# Altium project ANALOG_CAN_BOARD_2018.PrjPCB
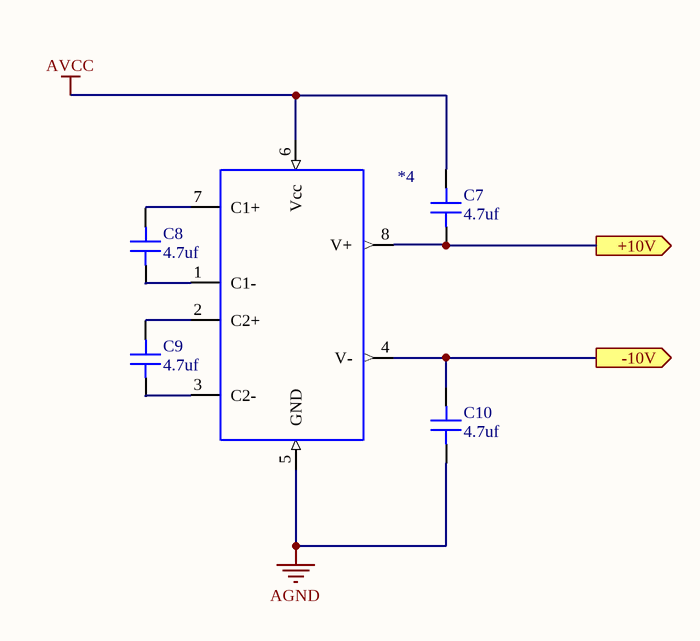
[diagram p0: MAX680_10V_Converter.SchDoc]
6 sheets, 50 parts. Net scope: hierarchical (ports join the sheet entries above them; power ports are global).
Board file: ANALOG_CAN2.PcbDoc
Sheets:
  MAX680_10V_Converter.SchDoc
  TopLevel.SchDoc
    U_Connectors = Connectors.SchDoc
    U_5V Reference = 5V Reference.SchDoc
    U_OVP_MCU_PINS = OVP_MCU_PINS.SchDoc
  Sallen-Key Filter.SchDoc

## Sheet MAX680_10V_Converter.SchDoc
size A

### Parts
*4  Null  [SOIC-8]  (value not drawn)
C7  value 4.7uf  [CAP 0805/2012]  (hidden comment: Capacitor MLCC 4.7uf 16V CAP 0805/2012)
C8  value 4.7uf  [CAP 0805/2012]  (hidden comment: Capacitor MLCC 4.7uf 16V CAP 0805/2012)
C9  value 4.7uf  [CAP 0805/2012]  (hidden comment: Capacitor MLCC 4.7uf 16V CAP 0805/2012)
C10  value 4.7uf  [CAP 0805/2012]  (hidden comment: Capacitor MLCC 4.7uf 16V CAP 0805/2012)

### Ports
+10V (out), -10V (out)

### Nets
AGND: *4.5(GND) C10.1
AVCC: *4.6(Vcc) C7.2
Net*4_1: *4.1(C1-) C8.1
Net*4_2: *4.2(C2+) C9.2
Net*4_3: *4.3(C2-) C9.1
Net*4_4: *4.4(V-) C10.2 ; port -10V
Net*4_7: *4.7(C1+) C8.2
Net*4_8: *4.8(V+) C7.1 ; port +10V

### Library data of the parts
*4 = 14: IC REG SWTCHD CAP INV 10MA 8SOIC; Manufacturer_id: 1; idPMIC_Lin: 14; Name: MAX680CSA; Value: 10V; Output_Config: Fixed; Num_Outputs: 2; Vin(Min): 2V; Vin(Max): 6V; Vout(Min): +2Vin; Created_By: Albert Panuco; Drawer_id: 1; Power: Null; Vout(Max): 10V; Vout_Type: Null; Current_Rating: 10mA; Dropout_Voltage: Null; Package: SOIC-8; MfrPartNo: MAX680CSA; Link: https://www.digikey.com/product-detail/en/maxim-integrated/MAX680CSA/MAX680CSA-ND/142563; ComponentLink1Description: Null; ComponentLink1URL: Null; Supplier1: Null; Supplier1PartNo: Null; Updated_By: Null
C7-C10 = 353: Manufacturer_id: 1; idCapacitor: 353; Name: Cap_4.7uf_16V_CAP 0805/2012; Dielectric: Ceramic; Created_By: Nick Mah; Drawer_id: 1; Voltage_Rating: 16V; Package: CAP 0805/2012; Created_Date: 10/20/2018

## Sheet TopLevel.SchDoc
size A
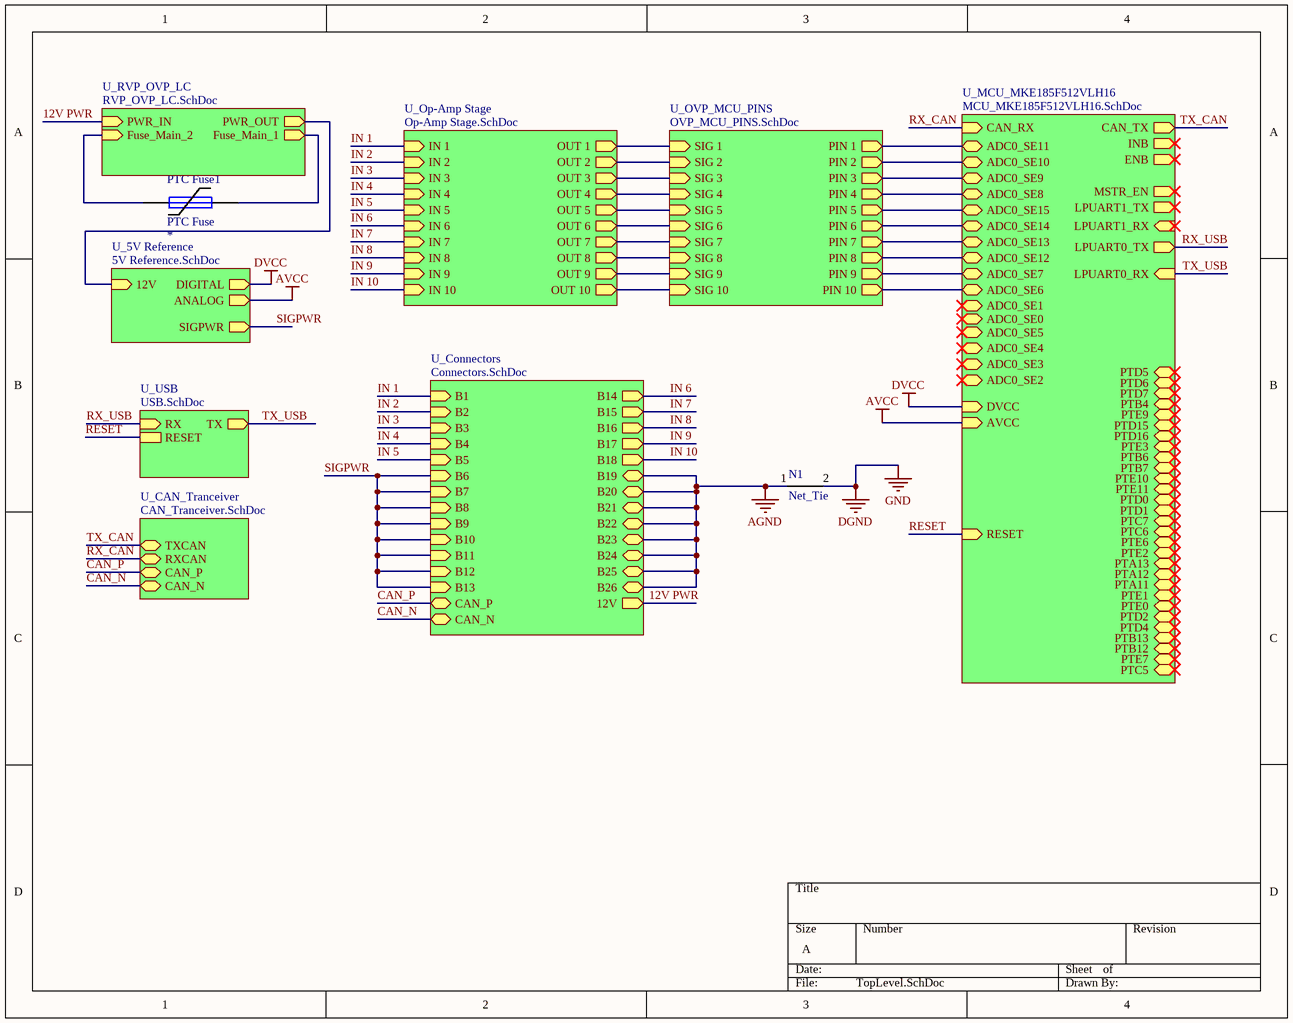
[diagram p1: TopLevel.SchDoc]

### Parts
N1  Net_Tie  [Net_Tie]  (net tie, no BOM)
PTC_Fuse1  PTC Fuse  [PTC Fuse 2920/07351]

### Sub-sheets
U_5V Reference = 5V Reference.SchDoc: 12V (in), DIGITAL (out), ANALOG (out), SIGPWR (out)
U_CAN_Tranceiver = CAN_Tranceiver.SchDoc (file not in this document): TXCAN (bidir), RXCAN (bidir), CAN_P (bidir), CAN_N (bidir)
U_Connectors = Connectors.SchDoc: B1 (in), B2 (in), B3 (in), B4 (in), B5 (in), B6 (in), B7 (in), B8 (in), B9 (in), B10 (in), B11 (in), B12 (in), B13 (in), B14 (out), B15 (out), B16 (out), B17 (out), B18 (out), B19 (bidir), B20 (bidir), B21 (bidir), B22 (bidir), B23 (bidir), B24 (bidir), B25 (bidir), B26 (bidir), 12V (out), CAN_N (bidir), CAN_P (bidir)
U_MCU_MKE185F512VLH16 = MCU_MKE185F512VLH16.SchDoc (file not in this document): CAN_TX (out), CAN_RX (in), INB (out), ENB (out), ADC0_SE11 (bidir), ADC0_SE10 (bidir), ADC0_SE9 (bidir), ADC0_SE8 (bidir), ADC0_SE15 (bidir), ADC0_SE14 (bidir), ADC0_SE13 (bidir), ADC0_SE12 (bidir), ADC0_SE7 (bidir), ADC0_SE6 (bidir), ADC0_SE1 (bidir), ADC0_SE0 (bidir), LPUART0_TX (out), LPUART0_RX (in), MSTR_EN (out), ADC0_SE5 (bidir), ADC0_SE4 (bidir), LPUART1_TX (out), LPUART1_RX (in), ADC0_SE3 (bidir), ADC0_SE2 (bidir), DVCC (in), AVCC (in), PTD5 (bidir), PTD6 (bidir), PTD7 (bidir), PTB4 (bidir), PTE9 (bidir), PTD15 (bidir), PTD16 (bidir), PTE3 (bidir), PTB6 (bidir), PTB7 (bidir), PTE10 (bidir), PTE11 (bidir), PTD0 (bidir), PTD1 (bidir), PTC7 (bidir), PTC6 (bidir), PTE6 (bidir), PTE2 (bidir), PTA13 (bidir), PTA12 (bidir), PTA11 (bidir), PTE1 (bidir), PTE0 (bidir), RESET (in), PTD2 (bidir), PTD4 (bidir), PTB13 (bidir), PTB12 (bidir), PTE7 (bidir), PTC5 (bidir)
U_Op-Amp Stage = Op-Amp Stage.SchDoc (file not in this document): OUT 1 (out), OUT 2 (out), OUT 3 (out), OUT 4 (out), OUT 5 (out), OUT 6 (out), OUT 7 (out), OUT 8 (out), OUT 9 (out), OUT 10 (out), IN 1 (in), IN 2 (in), IN 3 (in), IN 4 (in), IN 5 (in), IN 6 (in), IN 7 (in), IN 8 (in), IN 9 (in), IN 10 (in)
U_OVP_MCU_PINS = OVP_MCU_PINS.SchDoc: SIG 1 (in), SIG 2 (in), PIN 1 (out), PIN 2 (out), SIG 3 (in), SIG 4 (in), PIN 3 (out), PIN 4 (out), SIG 5 (in), SIG 6 (in), PIN 5 (out), PIN 6 (out), SIG 7 (in), SIG 8 (in), PIN 7 (out), PIN 8 (out), SIG 9 (in), SIG 10 (in), PIN 9 (out), PIN 10 (out)
U_RVP_OVP_LC = RVP_OVP_LC.SchDoc (file not in this document): PWR_IN (in), PWR_OUT (out), Fuse_Main_2 (in), Fuse_Main_1 (out)
U_USB = USB.SchDoc (file not in this document): TX (out), RX (in), RESET

### Nets
AGND: N1.1 ; sheet U_Connectors/B19, sheet U_Connectors/B20, sheet U_Connectors/B21, sheet U_Connectors/B22, sheet U_Connectors/B23, sheet U_Connectors/B24, sheet U_Connectors/B25, sheet U_Connectors/B26
AVCC: sheet U_5V Reference/ANALOG, sheet U_MCU_MKE185F512VLH16/AVCC
DGND: N1.2  [also labelled GND]
DVCC: sheet U_5V Reference/DIGITAL, sheet U_MCU_MKE185F512VLH16/DVCC
12V: sheet U_RVP_OVP_LC/PWR_OUT, sheet U_5V Reference/12V
12V PWR: sheet U_RVP_OVP_LC/PWR_IN, sheet U_Connectors/12V
CAN_N: sheet U_CAN_Tranceiver/CAN_N, sheet U_Connectors/CAN_N
CAN_P: sheet U_CAN_Tranceiver/CAN_P, sheet U_Connectors/CAN_P
IN 1: sheet U_Connectors/B1, sheet U_Op-Amp Stage/IN 1
IN 2: sheet U_Connectors/B2, sheet U_Op-Amp Stage/IN 2
IN 3: sheet U_Connectors/B3, sheet U_Op-Amp Stage/IN 3
IN 4: sheet U_Connectors/B4, sheet U_Op-Amp Stage/IN 4
IN 5: sheet U_Connectors/B5, sheet U_Op-Amp Stage/IN 5
IN 6: sheet U_Connectors/B14, sheet U_Op-Amp Stage/IN 6
IN 7: sheet U_Connectors/B15, sheet U_Op-Amp Stage/IN 7
IN 8: sheet U_Connectors/B16, sheet U_Op-Amp Stage/IN 8
IN 9: sheet U_Connectors/B17, sheet U_Op-Amp Stage/IN 9
IN 10: sheet U_Connectors/B18, sheet U_Op-Amp Stage/IN 10
RESET: sheet U_USB/RESET, sheet U_MCU_MKE185F512VLH16/RESET
RX_CAN: sheet U_CAN_Tranceiver/RXCAN, sheet U_MCU_MKE185F512VLH16/CAN_RX
RX_USB: sheet U_USB/RX, sheet U_MCU_MKE185F512VLH16/LPUART0_TX
SIGPWR: sheet U_Connectors/B6, sheet U_Connectors/B7, sheet U_Connectors/B8, sheet U_Connectors/B9, sheet U_Connectors/B10, sheet U_Connectors/B11, sheet U_Connectors/B12, sheet U_Connectors/B13, sheet U_5V Reference/SIGPWR
TX_CAN: sheet U_CAN_Tranceiver/TXCAN, sheet U_MCU_MKE185F512VLH16/CAN_TX
TX_USB: sheet U_USB/TX, sheet U_MCU_MKE185F512VLH16/LPUART0_RX
NetA1_1: sheet U_OVP_MCU_PINS/PIN 1, sheet U_MCU_MKE185F512VLH16/ADC0_SE11
NetA1_2: sheet U_OVP_MCU_PINS/PIN 2, sheet U_MCU_MKE185F512VLH16/ADC0_SE10
NetA2_1: sheet U_OVP_MCU_PINS/PIN 3, sheet U_MCU_MKE185F512VLH16/ADC0_SE9
NetA2_2: sheet U_OVP_MCU_PINS/PIN 4, sheet U_MCU_MKE185F512VLH16/ADC0_SE8
NetA3_1: sheet U_OVP_MCU_PINS/PIN 5, sheet U_MCU_MKE185F512VLH16/ADC0_SE15
NetA3_2: sheet U_OVP_MCU_PINS/PIN 6, sheet U_MCU_MKE185F512VLH16/ADC0_SE14
NetA4_1: sheet U_OVP_MCU_PINS/PIN 7, sheet U_MCU_MKE185F512VLH16/ADC0_SE13
NetA4_2: sheet U_OVP_MCU_PINS/PIN 8, sheet U_MCU_MKE185F512VLH16/ADC0_SE12
NetA5_1: sheet U_OVP_MCU_PINS/PIN 9, sheet U_MCU_MKE185F512VLH16/ADC0_SE7
NetA5_2: sheet U_OVP_MCU_PINS/PIN 10, sheet U_MCU_MKE185F512VLH16/ADC0_SE6
NetPTC_Fuse1_1: PTC_Fuse1.1 ; sheet U_RVP_OVP_LC/Fuse_Main_2
NetPTC_Fuse1_2: PTC_Fuse1.2 ; sheet U_RVP_OVP_LC/Fuse_Main_1
NetR6_2: sheet U_OVP_MCU_PINS/SIG 1, sheet U_Op-Amp Stage/OUT 1
NetR7_2: sheet U_OVP_MCU_PINS/SIG 2, sheet U_Op-Amp Stage/OUT 2
NetR8_2: sheet U_OVP_MCU_PINS/SIG 3, sheet U_Op-Amp Stage/OUT 3
NetR9_2: sheet U_OVP_MCU_PINS/SIG 4, sheet U_Op-Amp Stage/OUT 4
NetR10_2: sheet U_OVP_MCU_PINS/SIG 5, sheet U_Op-Amp Stage/OUT 5
NetR11_2: sheet U_OVP_MCU_PINS/SIG 6, sheet U_Op-Amp Stage/OUT 6
NetR12_2: sheet U_OVP_MCU_PINS/SIG 7, sheet U_Op-Amp Stage/OUT 7
NetR13_2: sheet U_OVP_MCU_PINS/SIG 8, sheet U_Op-Amp Stage/OUT 8
NetR14_2: sheet U_OVP_MCU_PINS/SIG 9, sheet U_Op-Amp Stage/OUT 9
NetR15_2: sheet U_OVP_MCU_PINS/SIG 10, sheet U_Op-Amp Stage/OUT 10

### Library data of the parts
N1 = 1: Manufacturer_id: 1; idFuse: 3; Name: Net Tie; Drawer_id: 1; idShunt: 1
PTC_Fuse1 = 4: Fuse; Manufacturer_id: 1; MfrPartNo: 2920L200; idFuse: 4; Name: PTC Poly Fuse Resettable; Value: 2A hold, 4A trip, 40A max; I_hold: 2A; I_trip: 4A; I_max: 40A; Created_By: Eunice Bernardo; Published: 8-Jun-2000; LatestRevisionDate: 17-Jul-2002; LatestRevisionNote: Re-released for DXP Platform.; PackageReference: PIN-W2/E2.8; Publisher: Altium Limited; PackageDescription: Thru-Hole; 2 Leads; I-hold: *; Drawer_id: 1; Link: https://www.digikey.com/product-detail/en/littelfuse-inc/2920L200-24DR/F2872TR-ND/1211346; Created_Date: 10/27/2018

## Sheet Connectors.SchDoc
size A
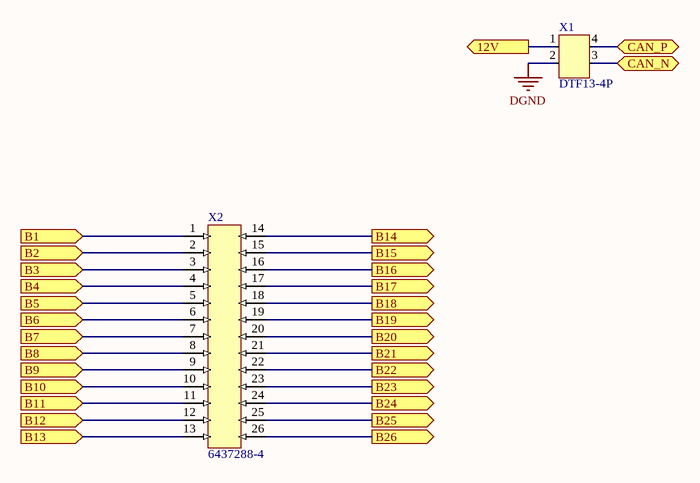
[diagram p2: Connectors.SchDoc]

### Parts
X1  DTF13-4P  [DTF13-4P]
X2  6437288-4  [SUPERSEAL 26POS 90Deg]

### Ports
12V (out), B1 (in), B2 (in), B3 (in), B4 (in), B5 (in), B6 (in), B7 (in), B8 (in), B9 (in), B10 (in), B11 (in), B12 (in), B13 (in), B14 (out), B15 (out), B16 (out), B17 (out), B18 (out), B19 (out), B20 (out), B21 (out), B22 (out), B23 (out), B24 (out), B25 (out), B26 (out), CAN_N (bidir), CAN_P (bidir)

### Nets
AGND: X2.19 X2.20 X2.21 X2.22 X2.23 X2.24 X2.25 X2.26 ; port B19, port B20, port B21, port B22, port B23, port B24, port B25, port B26
DGND: X1.2
12V PWR: X1.1 ; port 12V
CAN_N: X1.3 ; port CAN_N
CAN_P: X1.4 ; port CAN_P
IN 1: X2.1 ; port B1
IN 2: X2.2 ; port B2
IN 3: X2.3 ; port B3
IN 4: X2.4 ; port B4
IN 5: X2.5 ; port B5
IN 6: X2.14 ; port B14
IN 7: X2.15 ; port B15
IN 8: X2.16 ; port B16
IN 9: X2.17 ; port B17
IN 10: X2.18 ; port B18
SIGPWR: X2.6 X2.7 X2.8 X2.9 X2.10 X2.11 X2.12 X2.13 ; port B6, port B7, port B8, port B9, port B10, port B11, port B12, port B13

### Library data of the parts
X1 = 15: 2 row 4 pin Board; Manufacturer_id: 1; idConn: 15; Value: CONN; Num_Contacts: 4; Created_By: Angel; MfrPartNo: DTF13-4P; Drawer_id: 1; Name: DTF13-4P; Link: https://www.te.com/usa-en/product-DTF13-4P.html; ComponentLink1Description: Datasheet; Supplier1: TE
X2 = 21: 4 row connector; Manufacturer_id: 1; idConn: 21; Name: AMP Superseal 90Deg; Value: CONN; Num_Contacts: 26; Num_Rows: 4; Pitch: 3mm; Created_By: Angel; MfrPartNo: 6437288-4; Drawer_id: 1; Link: https://www.te.com/usa-en/product-6437288-4.html#guest-click; ComponentLink1Description: Datasheet; Supplier1: TE

## Sheet 5V Reference.SchDoc
size A
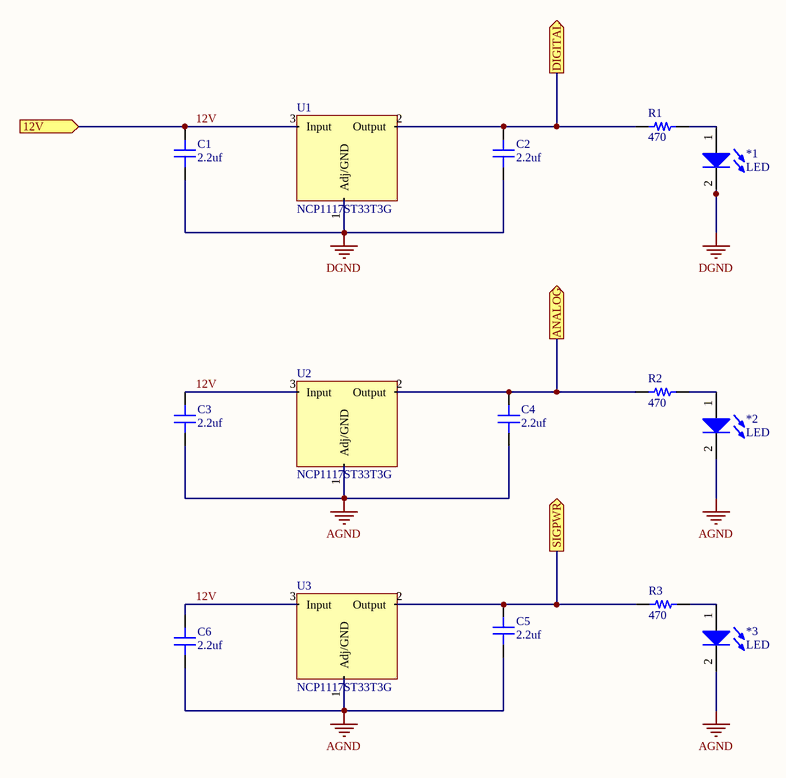
[diagram p3: 5V Reference.SchDoc]

### Parts
*1  LED  [0805_LED]
*2  LED  [0805_LED]
*3  LED  [0805_LED]
C1  value 2.2uf  [CAP 0805/2012]  (hidden comment: Capacitor MLCC 2.2uf 25V CAP 0805/2012)
C2  value 2.2uf  [CAP 0805/2012]  (hidden comment: Capacitor MLCC 2.2uf 25V CAP 0805/2012)
C3  value 2.2uf  [CAP 0805/2012]  (hidden comment: Capacitor MLCC 2.2uf 25V CAP 0805/2012)
C4  value 2.2uf  [CAP 0805/2012]  (hidden comment: Capacitor MLCC 2.2uf 25V CAP 0805/2012)
C5  value 2.2uf  [CAP 0805/2012]  (hidden comment: Capacitor MLCC 2.2uf 25V CAP 0805/2012)
C6  value 2.2uf  [CAP 0805/2012]  (hidden comment: Capacitor MLCC 2.2uf 25V CAP 0805/2012)
R1  value 470  [RES 0805/2012]  (hidden comment: Resistor 470 0805 1/10W 1%)
R2  value 470  [RES 0805/2012]  (hidden comment: Resistor 470 0805 1/10W 1%)
R3  value 470  [RES 0805/2012]  (hidden comment: Resistor 470 0805 1/10W 1%)
U1  NCP1117ST33T3G  [SOT-223-3]
U2  NCP1117ST33T3G  [SOT-223-3]
U3  NCP1117ST33T3G  [SOT-223-3]

### Ports
12V (in), ANALOG (out), DIGITAL (out), SIGPWR (out)

### Nets
AGND: *2.2(K) *3.2(K) C3.1 C4.1 C5.1 C6.1 U2.1(Adj/GND) U3.1(Adj/GND)
AVCC: C4.2 R2.1 U2.2(Output) ; port ANALOG
DGND: *1.2(K) C1.1 C2.1 U1.1(Adj/GND)
DVCC: C2.2 R1.1 U1.2(Output) ; port DIGITAL
12V: C1.2 C3.2 C6.2 U1.3(Input) U2.3(Input) U3.3(Input) ; port 12V
SIGPWR: C5.2 R3.1 U3.2(Output) ; port SIGPWR
Net*1_1: *1.1(A) R1.2
Net*2_1: *2.1(A) R2.2
Net*3_1: *3.1(A) R3.2

### Library data of the parts
*1-*3 = 2: Manufacturer_id: 1; idLED: 2; Name: CMD17_0805_GREEN; Value: Green; Brightness: 7mcd; Id: 20mA; Vf: 2.1V; Drawer_id: 1; Package: 0805; Link: https://www.digikey.com/product-detail/en/visual-communications-company-vcc/CMD17-21VGD-TR8/L62505CT-ND/254936
C1-C6 = 711: Manufacturer_id: 1; idCapacitor: 711; Name: Cap_2.2uf_25V_CAP 0805/2012; Dielectric: Ceramic; Created_By: Nick Mah; Drawer_id: 1; Voltage_Rating: 25V; Package: CAP 0805/2012; Created_Date: 10/20/2018
R1-R3 = 497: Manufacturer_id: 1; idResistor: 497; Name: Res_470_0805_1/10W_1%; Created_By: Nick Mah; Supplier 1: Digi-Key; Drawer_id: 1; Tolerance: 1%; Power: 1/10W; Package: 0805; ComponentLink1Description: Datasheet; Created_Date: 2018-10-20
U1-U3 = 15: 1.0 A Low Dropout Positive and Adjustable Voltage Regulator; Manufacturer_id: 1; idPMIC_Lin: 15; Name: 3.3V 1.0A LDO; Value: 3.3V 1.0A; Vin(Max): 20V; Vout(Max): 3.3V; Current_Rating: 1A; Dropout_Voltage: 1.2V @ 800mA; Drawer_id: 1; Num_Outputs: 1; Package: SOT-223-3; MfrPartNo: NCP1117ST33T3G; Link: https://www.digikey.com/product-detail/en/on-semiconductor/NCP1117ST33T3G/NCP1117ST33T3GOSCT-ND/660708?utm_adgroup=Integrated%20Circuits&slid=&gclid=CjwKCAjwpKveBRAwEiwAo4Pqm-q33kFM8zFNc6HZ2F-pR13_ETd6YlqjCAqcJjAXoyQWdArbQQWp4hoCk3EQAvD_BwE

## Sheet OVP_MCU_PINS.SchDoc
size A
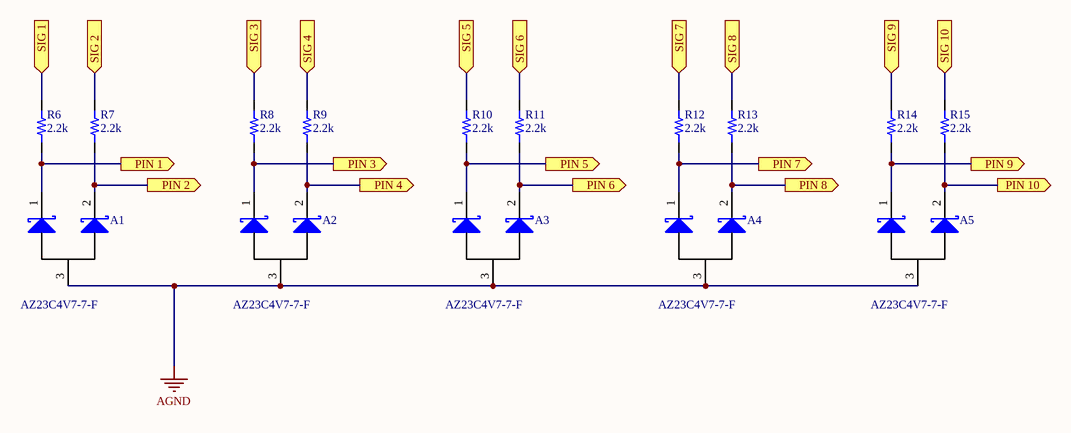
[diagram p4: OVP_MCU_PINS.SchDoc]

### Parts
A1  AZ23C4V7-7-F  [SOT23-3]
A2  AZ23C4V7-7-F  [SOT23-3]
A3  AZ23C4V7-7-F  [SOT23-3]
A4  AZ23C4V7-7-F  [SOT23-3]
A5  AZ23C4V7-7-F  [SOT23-3]
R6  value 2.2k  [RES 0805/2012]  (hidden comment: Resistor 2.2k 0805 1/4W 5%)
R7  value 2.2k  [RES 0805/2012]  (hidden comment: Resistor 2.2k 0805 1/4W 5%)
R8  value 2.2k  [RES 0805/2012]  (hidden comment: Resistor 2.2k 0805 1/4W 5%)
R9  value 2.2k  [RES 0805/2012]  (hidden comment: Resistor 2.2k 0805 1/4W 5%)
R10  value 2.2k  [RES 0805/2012]  (hidden comment: Resistor 2.2k 0805 1/4W 5%)
R11  value 2.2k  [RES 0805/2012]  (hidden comment: Resistor 2.2k 0805 1/4W 5%)
R12  value 2.2k  [RES 0805/2012]  (hidden comment: Resistor 2.2k 0805 1/4W 5%)
R13  value 2.2k  [RES 0805/2012]  (hidden comment: Resistor 2.2k 0805 1/4W 5%)
R14  value 2.2k  [RES 0805/2012]  (hidden comment: Resistor 2.2k 0805 1/4W 5%)
R15  value 2.2k  [RES 0805/2012]  (hidden comment: Resistor 2.2k 0805 1/4W 5%)

### Ports
PIN 1 (out), PIN 2 (out), PIN 3 (out), PIN 4 (out), PIN 5 (out), PIN 6 (out), PIN 7 (out), PIN 8 (out), PIN 9 (out), PIN 10 (out), SIG 1 (in), SIG 2 (in), SIG 3 (in), SIG 4 (in), SIG 5 (in), SIG 6 (in), SIG 7 (in), SIG 8 (in), SIG 9 (in), SIG 10 (in)

### Nets
AGND: A1.3 A2.3 A3.3 A4.3 A5.3
NetA1_1: A1.1 R6.1 ; port PIN 1
NetA1_2: A1.2 R7.1 ; port PIN 2
NetA2_1: A2.1 R8.1 ; port PIN 3
NetA2_2: A2.2 R9.1 ; port PIN 4
NetA3_1: A3.1 R10.1 ; port PIN 5
NetA3_2: A3.2 R11.1 ; port PIN 6
NetA4_1: A4.1 R12.1 ; port PIN 7
NetA4_2: A4.2 R13.1 ; port PIN 8
NetA5_1: A5.1 R14.1 ; port PIN 9
NetA5_2: A5.2 R15.1 ; port PIN 10
NetR6_2: R6.2 ; port SIG 1
NetR7_2: R7.2 ; port SIG 2
NetR8_2: R8.2 ; port SIG 3
NetR9_2: R9.2 ; port SIG 4
NetR10_2: R10.2 ; port SIG 5
NetR11_2: R11.2 ; port SIG 6
NetR12_2: R12.2 ; port SIG 7
NetR13_2: R13.2 ; port SIG 8
NetR14_2: R14.2 ; port SIG 9
NetR15_2: R15.2 ; port SIG 10

### Library data of the parts
A1-A5 = 14: DIODE ZENER ARRAY 4.7V SOT23-3; Manufacturer_id: 1; idDiode: 14; Num_Circuits: 2; Power: 300mW; Created_By: Angel Delgado; Drawer_id: 1; Name: AZ23C4V7-7-F; Value: 4.7V; Type: Zener Array; Package: SOT23-3; MfrPartNo: AZ23C4V7-7-F; Link: https://www.digikey.com/product-detail/en/diodes-incorporated/AZ23C4V7-7-F/AZ23C4V7-FDICT-ND/815309; Supplier1: Digi-Key
R6-R15 = 1809: Manufacturer_id: 1; idResistor: 1809; Name: Res_2.2k_0805_1/4W_5%; Created_By: Nick Mah; Supplier 1: Digi-Key; Drawer_id: 1; Tolerance: 5%; Power: 1/4W; Package: 0805; ComponentLink1Description: Datasheet; Created_Date: 2018-10-20

## Sheet Sallen-Key Filter.SchDoc
size A
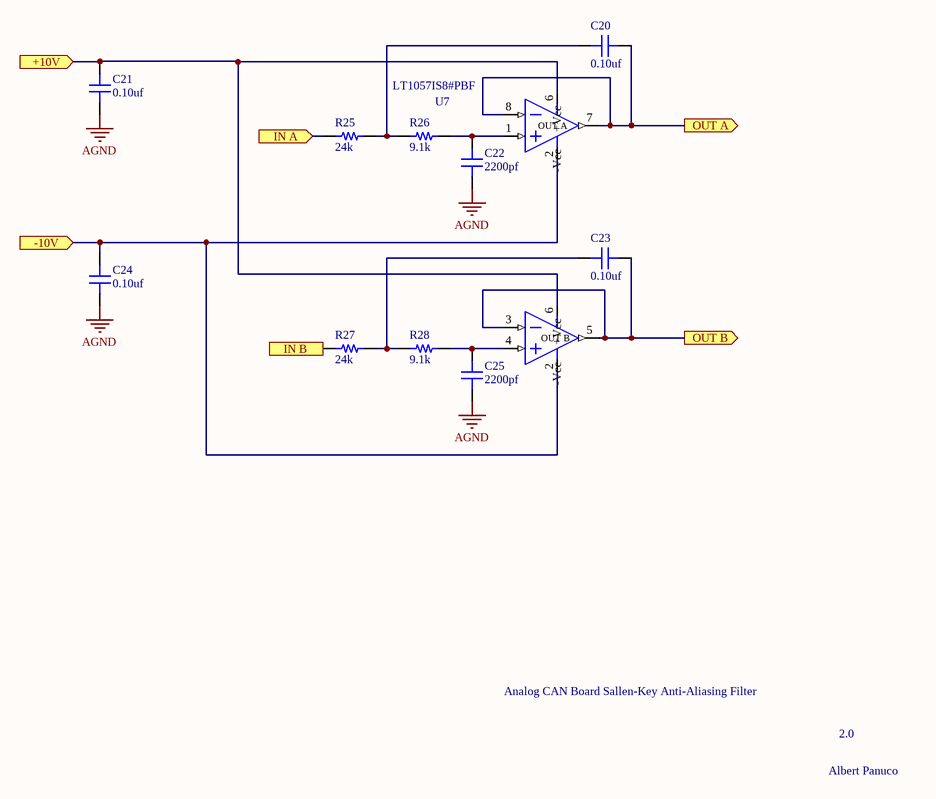
[diagram p5: Sallen-Key Filter.SchDoc]

### Parts
C20  value 0.10uf  [CAP 0805/2012]  (hidden comment: Capacitor MLCC 0.10uf 25V CAP 0805/2012)
C21  value 0.10uf  [CAP 0805/2012]  (hidden comment: Capacitor MLCC 0.10uf 25V CAP 0805/2012)
C22  value 2200pf  [CAP 0805/2012]  (hidden comment: Capacitor MLCC 2200pf 25V CAP 0805/2012)
C23  value 0.10uf  [CAP 0805/2012]  (hidden comment: Capacitor MLCC 0.10uf 25V CAP 0805/2012)
C24  value 0.10uf  [CAP 0805/2012]  (hidden comment: Capacitor MLCC 0.10uf 25V CAP 0805/2012)
C25  value 2200pf  [CAP 0805/2012]  (hidden comment: Capacitor MLCC 2200pf 25V CAP 0805/2012)
R25  value 24k  [RES 0805/2012]  (hidden comment: Resistor 24k 0805 1/10W 1%)
R26  value 9.1k  [RES 0805/2012]  (hidden comment: Resistor 9.1k 0805 1/10W 1%)
R27  value 24k  [RES 0805/2012]  (hidden comment: Resistor 24k 0805 1/10W 1%)
R28  value 9.1k  [RES 0805/2012]  (hidden comment: Resistor 9.1k 0805 1/10W 1%)
U7  LT1057IS8#PBF  [SOIC-8]

### Ports
+10V (in), -10V (in), IN A (in), IN B (in), OUT A (out), OUT B (out)

### Nets
AGND: C21.1 C22.1 C24.2 C25.1
NetC20_1: C20.1 R25.2 R26.1
NetC20_2: C20.2 U7.7(OUT_A) U7.8(-IN_A) ; port OUT A
NetC21_2: C21.2 U7.6(+Vcc) ; port +10V
NetC22_2: C22.2 R26.2 U7.1(+IN_A)
NetC23_1: C23.1 R27.2 R28.1
NetC23_2: C23.2 U7.3(+IN_B) U7.5(OUT_B) ; port OUT B
NetC24_1: C24.1 U7.2(-Vcc) ; port -10V
NetC25_2: C25.2 R28.2 U7.4(+IN_B)
NetR25_1: R25.1 ; port IN A
NetR27_1: R27.1 ; port IN B

### Notes on the sheet
- Analog CAN Board Sallen-Key Anti-Aliasing Filter
- 2.0
- Albert Panuco

### Library data of the parts
C20 C21 C23 C24 = 703: Manufacturer_id: 1; idCapacitor: 703; Name: Cap_0.10uf_25V_CAP 0805/2012; Dielectric: Ceramic; Created_By: Nick Mah; Drawer_id: 1; Voltage_Rating: 25V; Package: CAP 0805/2012; Created_Date: 10/20/2018
C22 C25 = 681: Manufacturer_id: 1; idCapacitor: 681; Name: Cap_2200pf_25V_CAP 0805/2012; Dielectric: Ceramic; Created_By: Nick Mah; Drawer_id: 1; Voltage_Rating: 25V; Package: CAP 0805/2012; Created_Date: 10/20/2018
R25 R27 = 538: Manufacturer_id: 1; idResistor: 538; Name: Res_24k_0805_1/10W_1%; Created_By: Nick Mah; Supplier 1: Digi-Key; Drawer_id: 1; Tolerance: 1%; Power: 1/10W; Package: 0805; ComponentLink1Description: Datasheet; Created_Date: 2018-10-20
R26 R28 = 528: Manufacturer_id: 1; idResistor: 528; Name: Res_9.1k_0805_1/10W_1%; Created_By: Nick Mah; Supplier 1: Digi-Key; Drawer_id: 1; Tolerance: 1%; Power: 1/10W; Package: 0805; ComponentLink1Description: Datasheet; Created_Date: 2018-10-20
U7 = 1: IC OPAMP JFET 5MHZ 8SO; idOp_Amp: 1; Num_Circuits: 2; Slew_Rate: 13 V/us; Supply_Voltage: 10~18; Created_By: Albert Panuco; Manufacturer_id: 1; Drawer_id: 1; Name: OPAMP JFET; Amplifier_Type: JFET; GBW: 5MHz; Package: 8-SO; MfrPartNo: LT1057IS8#PBF; Link: https://www.digikey.com/product-detail/en/linear-technology-analog-devices/LT1057IS8-PBF/LT1057IS8-PBF-ND/961410; Supplier1: Digikey; Supplier1PartNo: LT1057IS8#PBF-ND

## Nets that join several sheets
AGND: MAX680_10V_Converter (*4.5 C10.1), TopLevel (N1.1), Connectors (8 pins), 5V Reference (8 pins), OVP_MCU_PINS (5 pins), Sallen-Key Filter (C21.1 C22.1 C24.2 C25.1)
AVCC: MAX680_10V_Converter (*4.6 C7.2), 5V Reference (C4.2 R2.1 U2.2)
DGND: TopLevel (N1.2), Connectors (X1.2), 5V Reference (*1.2 C1.1 C2.1 U1.1)
SIGPWR: Connectors (8 pins), 5V Reference (C5.2 R3.1 U3.2)